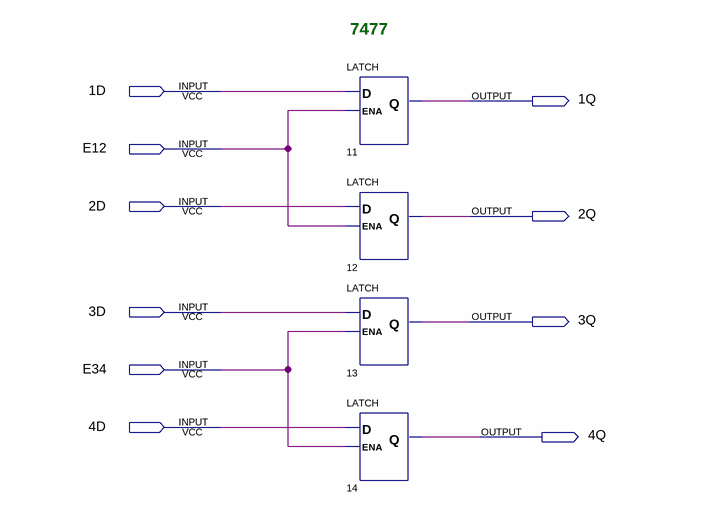
[diagram p0: schematic sheet]
// Quartus schematic 7477.bdf as structural Verilog: 4 symbols, 10 pins
module \7477  (
  input  \1D ,
  input  E12,
  input  \2D ,
  input  \3D ,
  input  E34,
  input  \4D ,
  output \1Q ,
  output \2Q ,
  output \3Q ,
  output \4Q 
);

  LATCH u_11 (.D(\1D ), .ENA(E12), .Q(\1Q ));
  LATCH u_12 (.D(\2D ), .ENA(E12), .Q(\2Q ));
  LATCH u_13 (.D(\3D ), .ENA(E34), .Q(\3Q ));
  LATCH u_14 (.D(\4D ), .ENA(E34), .Q(\4Q ));

  // Notes on the sheet:
  //   7477
endmodule
